# EAGLE schematic untitled (EAGLE 6.2)
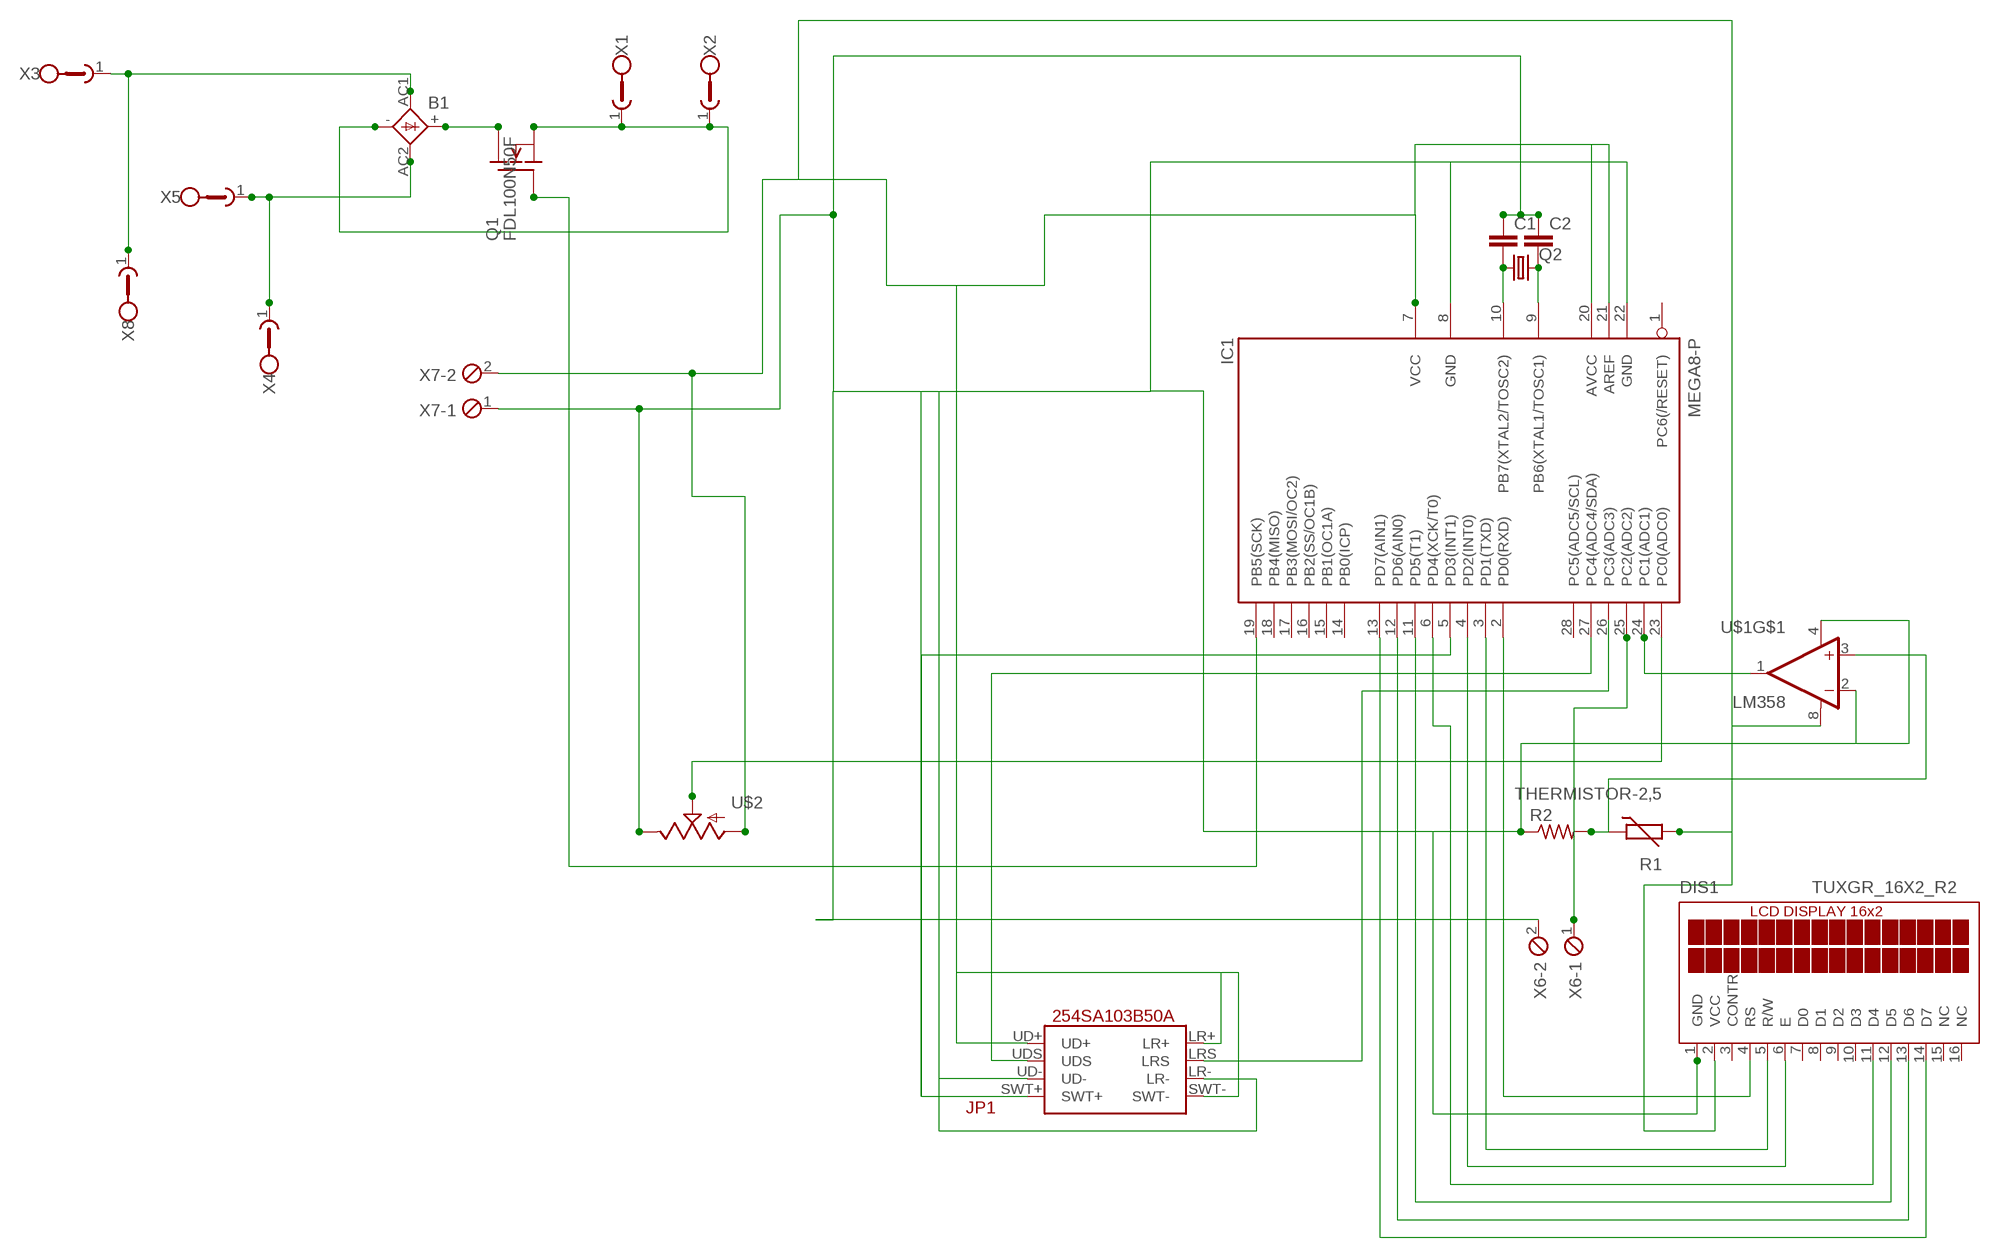
[diagram p0: schematic, sheet 1]

## Parts
B1  FBM  [FBM]
C1  CAPPTH1  [CAP-PTH-5MM]
C2  CAPPTH1  [CAP-PTH-5MM]
DIS1  TUXGR_16X2_R2  [TUXGR_16X2_R2]
IC1  MEGA8-P  [DIL28-3]
JP1  254SA103B50A  [254SA103B50A]
Q1  FDL100N50F  [TO264]
Q2  CRYSTALHC49U-V  [HC49U-V]
R1  THERMISTOR-2,5  [RS-2,5]
R2  R-US_0207/7  [0207/7]
U$1  LM358  [DIP08]
U$2  POT  [ALPS_POT]
X1  GMSTBA2ZFKDS475  [GMSTBA2]
X2  GMSTBA2ZFKDS475  [GMSTBA2]
X3  17805071780507  [1780507]
X4  17805071780507  [1780507]
X5  17805071780507  [1780507]
X6  MPT2  [2POL254]
X7  MPT2  [2POL254]
X8  17805071780507  [1780507]

## Nets
N$1: IC1.10(PB7(XTAL2/TOSC2)) Q2.1
N$2: B1.+ Q1.2(D)
N$3: B1.- Q1.3(S) X1.1 X2.1
N$4: IC1.19(PB5(SCK)) Q1.1(G)
N$5: IC1.25(PC2(ADC2)) X6.1
N$6: IC1.9(PB6(XTAL1/TOSC1)) Q2.2
N$7: B1.AC2 X4.1 X5.1
N$8: C1.2
N$9: C2.2
N$10: B1.AC1 X3.1 X8.1
N$11: IC1.24(PC1(ADC1)) U$1.1(OUT)
N$12: IC1.23(PC0(ADC0)) U$2.P$2(S)
N$13: DIS1.2(VCC) IC1.7(VCC) IC1.20(AVCC) IC1.21(AREF) JP1.LR+ JP1.SWT- JP1.UD+ R1.2 U$1.8(V+) U$2.P$3(A) X7.2
N$14: DIS1.6(E) IC1.4(PD2(INT0))
N$15: DIS1.11(D4) IC1.6(PD4(XCK/T0))
N$16: R1.1 R2.2 U$1.3(+IN)
N$17: DIS1.12(D5) IC1.11(PD5(T1))
N$18: DIS1.13(D6) IC1.12(PD6(AIN0))
N$19: DIS1.4(RS) IC1.2(PD0(RXD))
N$20: DIS1.5(R/W) IC1.3(PD1(TXD))
N$21: DIS1.14(D7) IC1.13(PD7(AIN1))
N$22: JP1.LRS
N$23: IC1.27(PC4(ADC4/SDA)) JP1.UDS
N$26: C1.1 C2.1 DIS1.1(GND) IC1.5(PD3(INT1)) IC1.8(GND) IC1.22(GND) JP1.LR- JP1.SWT+ JP1.UD- R2.1 U$1.2(-IN) U$1.4(V-) U$2.P$1(E) X6.2 X7.1
Unconnected: DIS1.3(CONTR) DIS1.7(D0) DIS1.8(D1) DIS1.9(D2) DIS1.10(D3) DIS1.15(NC) DIS1.16(NC) IC1.1(PC6(/RESET)) IC1.14(PB0(ICP)) IC1.15(PB1(OC1A)) IC1.16(PB2(SS/OC1B)) IC1.17(PB3(MOSI/OC2)) IC1.18(PB4(MISO)) IC1.26(PC3(ADC3)) IC1.28(PC5(ADC5/SCL)) U$1.5(+IN) U$1.6(-IN) U$1.7(OUT)

## Library data of the parts
B1 = rectifier:FBM: GENERAL INSTRUMENT RECTIFIER
C1 C2 = SparkFun:CAP: Capacitor Standard 0603 ceramic capacitor, and 0.1" leaded capacitor.
DIS1 = display-lcd:TUXGR_16X2_R2: Tuxgraphics LCD display 16x2 characters reflective, without background light Source: tuxgr_12x2_r2.pdf; OC_FARNELL: unknown; OC_NEWARK: unknown
IC1 = atmel:MEGA8-P: MICROCONTROLLER 8 Kbytes FLASH, 1 kbytes SRAM, 512 bytes EEPROM, USART, 4-channel 10 bit ADC, 2-channel 8 bit ADC Pin compatible with Atmega48, ATMega88, ATMega168 Source: avr.lbr; OC_FARNELL: unknown; OC_NEWARK: unknown
JP1 = Shaun:254SA103B50A
Q1 = Shaun:FDL100N50F: N-Channel Enhancement MOSFET not checked
Q2 = crystal:CRYSTAL: CRYSTAL; OC_FARNELL: 1666969; OC_NEWARK: unknown
R1 = varistor:THERMISTOR: THERMISTOR
R2 = resistor:R-US_: RESISTOR, American symbol
U$1 = SparkFun:LM358
U$2 = SparkFun:POT
X1 X2 = Shaun:GMSTBA2: PHOENIX; MF: FARNELL; MPN: 1757242; OC_FARNELL: 3705171; OC_NEWARK: 71C4161
X3-X5 X8 = Shaun:1780507: PHOENIX; MF: FARNELL; MPN: 1757242; OC_FARNELL: 3705171; OC_NEWARK: 71C4161
X6 X7 = con-phoenix-254:MPT2: PHOENIX CONNECTOR; OC_FARNELL: unknown; OC_NEWARK: unknown